# EasyEDA schematic SCH_jiji_2021-11-03.json
TITLE: Sheet_1; REV: 1.0; Date: 2021-10-26; Sheet: 1/1; Drawn By: wlshen; Company: Your Company
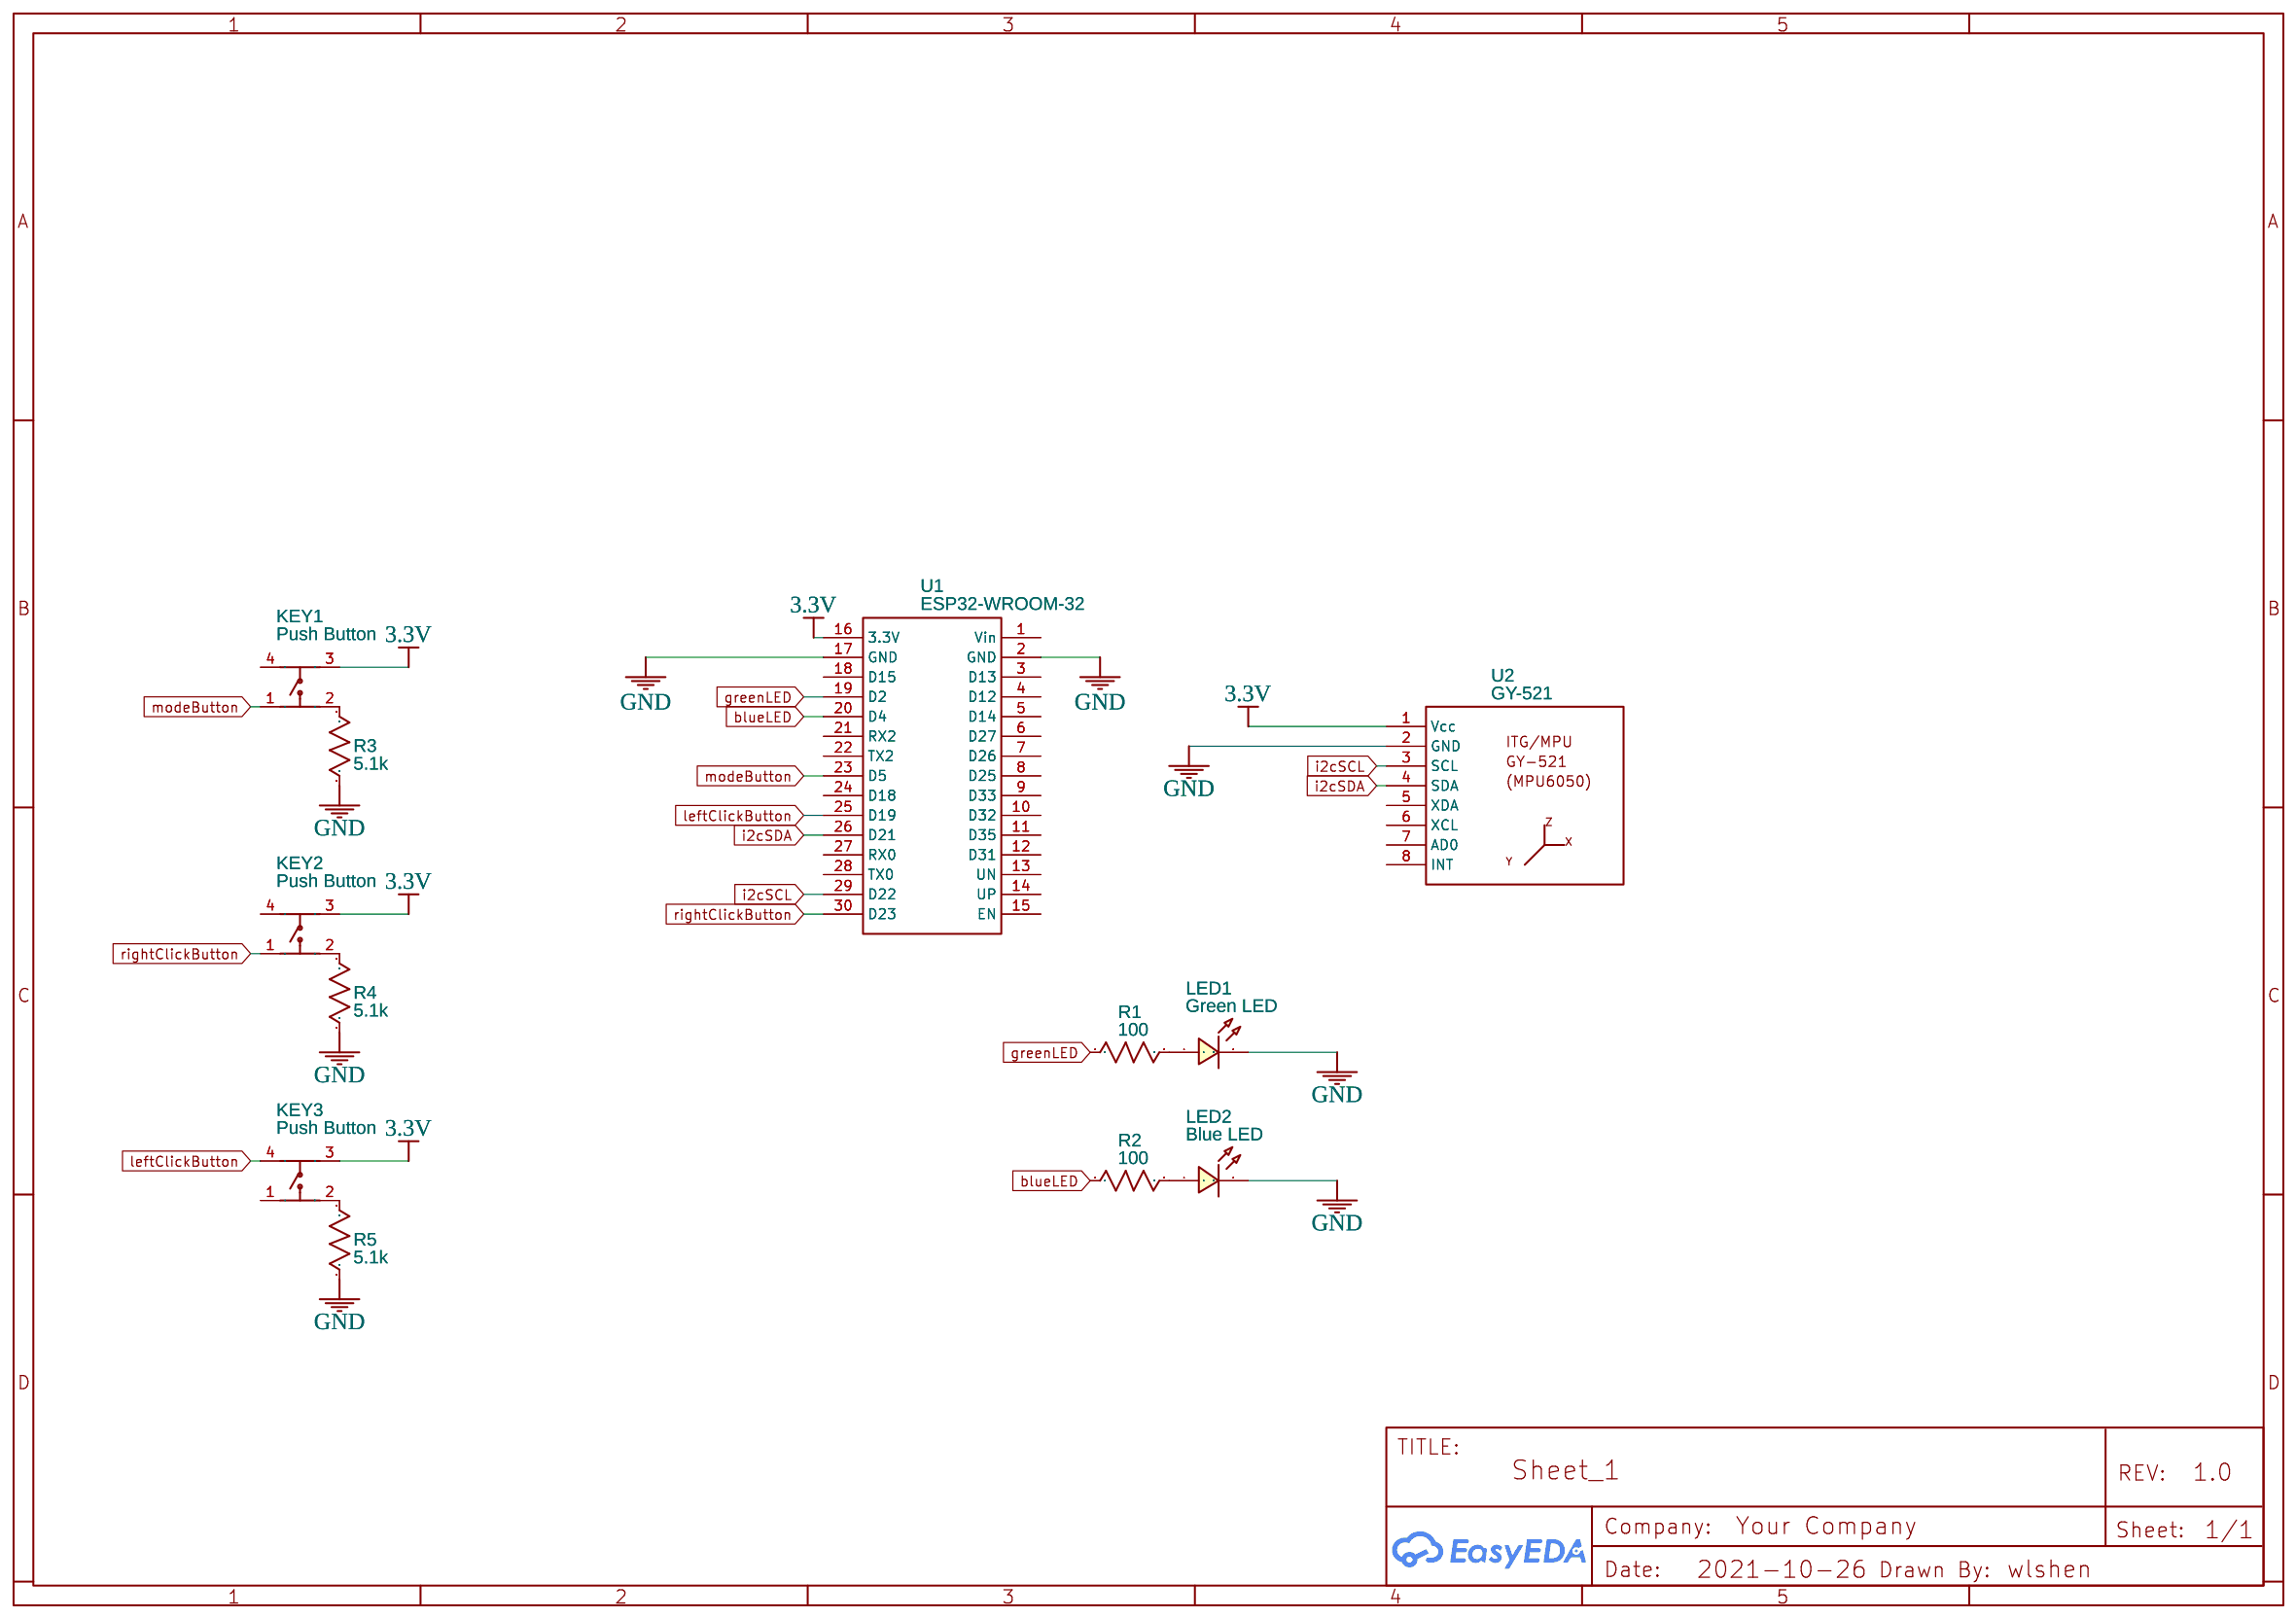
[diagram p0: schematic sheet]

## Parts
KEY1  Push Button  [KEY-TH_4P-L6.0-W6.0-P4.50-LS7.5]
KEY2  Push Button  [KEY-TH_4P-L6.0-W6.0-P4.50-LS7.5]
KEY3  Push Button  [KEY-TH_4P-L6.0-W6.0-P4.50-LS7.5]
LED1  Green LED  [LED0603_RED]
LED2  Blue LED  [LED0603_RED]
R1  100  [R0201]
R2  100  [R0201]
R3  5.1k  [R0201]
R4  5.1k  [R0201]
R5  5.1k  [R0201]
U1  ESP32-WROOM-32  [ESP32-WROOM-32]
U2  GY-521  [GY-521]

## Library data of the parts
KEY1-KEY3 = button6*6*8: Supplier Part: C59982; Supplier: LCSC; Manufacturer: ReliaPro
LED1 LED2 = LED-0603_R: Manufacturer: EVERLIGHT(台湾亿光); Manufacturer Part: 19-217/R6C-AL1M2VY/3T; Supplier Part: C72044; Supplier: LCSC; Contributor: LCEDA_01
R1-R5 = R_0201_US: Contributor: LCEDA_Lib
U1 = ESP32-WROOM-32: Manufacturer: Espressif; Supplier: Espressif; link: https://www.espressif.com/sites/default/files/documentation/esp32_datasheet_en.pdf; Contributor: neil060802
U2 = GY-521: Contributor: Юрий Владимирович (Duck Duck)

## Nets
3.3V: KEY1.3 KEY2.3 KEY3.3 U1.16(3.3V) U2.1(Vcc)
GND: LED1.2 LED2.2 R3.1 R4.1 R5.1 U1.2(GND) U1.17(GND) U2.2(GND)
blueLED: R2.1 U1.20(D4)
greenLED: R1.1 U1.19(D2)
i2cSCL: U1.29(D22) U2.3(SCL)
i2cSDA: U1.26(D21) U2.4(SDA)
leftClickButton: KEY3.4 U1.25(D19)
modeButton: KEY1.1 U1.23(D5)
rightClickButton: KEY2.1 U1.30(D23)
Net-(KEY1-2): KEY1.2 R3.2
Net-(KEY2-2): KEY2.2 R4.2
Net-(KEY3-2): KEY3.2 R5.2
Net-(LED1-1): LED1.1 R1.2
Net-(LED2-1): LED2.1 R2.2

Not connected (* = marked no-connect by the designer): KEY1 4; KEY2 4; KEY3 1; U1 1(Vin) 3(D13) 4(D12) 5(D14) 6(D27) 7(D26) 8(D25) 9(D33) 10(D32) 11(D35) 12(D31) 13(UN) 14(UP) 15(EN) 18(D15) 21(RX2) 22(TX2) 24(D18) 27(RX0) 28(TX0); U2 5(XDA) 6(XCL) 7(AD0) 8(INT)
